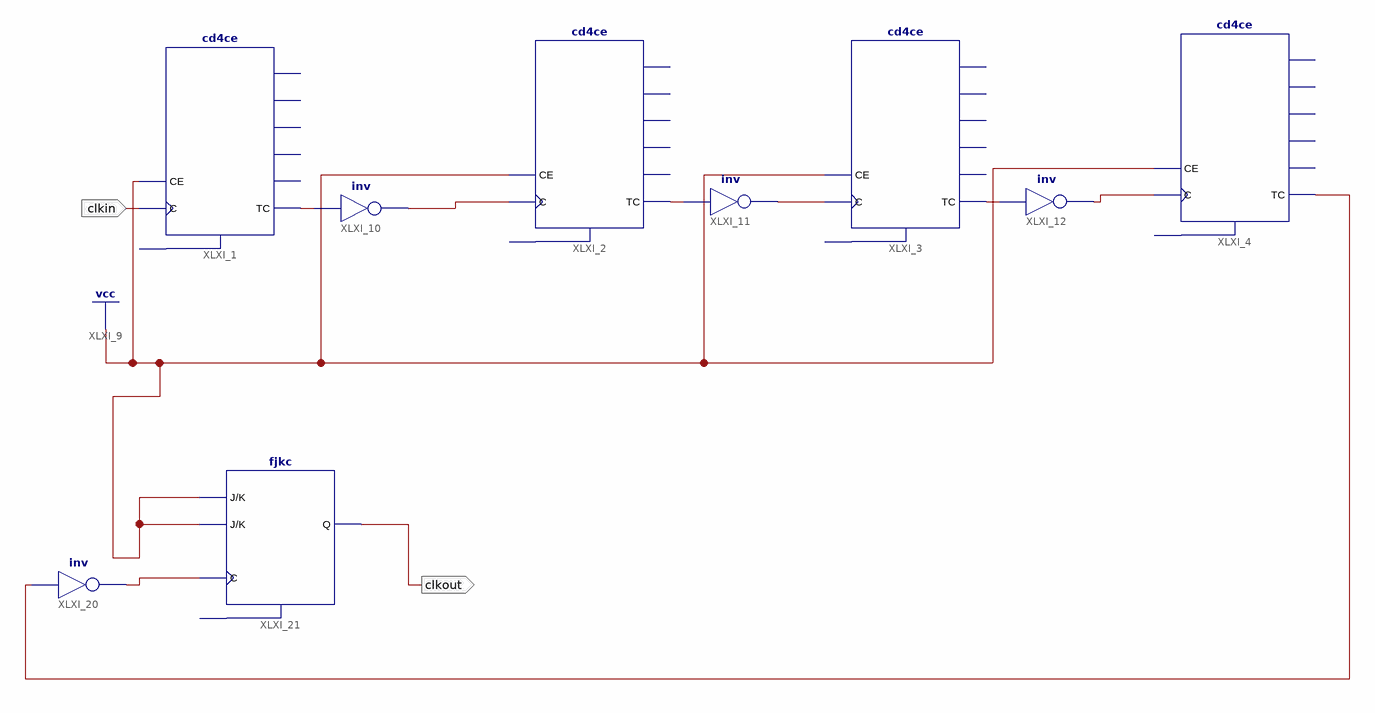
[diagram p0: schematic sheet 1]
// Xilinx ISE schematic divideto1k.sch (spartan6) as structural Verilog: 9 symbols, 2 ports
module divideto1k (
  input  clkin,
  output clkout
);

  wire XLXN_3, XLXN_4, XLXN_5, XLXN_10, XLXN_11, XLXN_12, XLXN_45, XLXN_48;

  cd4ce XLXI_1 (.C(clkin), .CE(1'b1), .TC(XLXN_3));  // open: CLR, CEO, Q0, Q1, Q2, Q3
  cd4ce XLXI_2 (.C(XLXN_10), .CE(1'b1), .TC(XLXN_4));  // open: CLR, CEO, Q0, Q1, Q2, Q3
  cd4ce XLXI_3 (.C(XLXN_11), .CE(1'b1), .TC(XLXN_5));  // open: CLR, CEO, Q0, Q1, Q2, Q3
  cd4ce XLXI_4 (.C(XLXN_12), .CE(1'b1), .TC(XLXN_45));  // open: CLR, CEO, Q0, Q1, Q2, Q3
  not XLXI_10 (XLXN_10, XLXN_3);
  not XLXI_11 (XLXN_11, XLXN_4);
  not XLXI_12 (XLXN_12, XLXN_5);
  not XLXI_20 (XLXN_48, XLXN_45);
  fjkc XLXI_21 (.C(XLXN_48), .J(1'b1), .K(1'b1), .Q(clkout));  // open: CLR
endmodule
